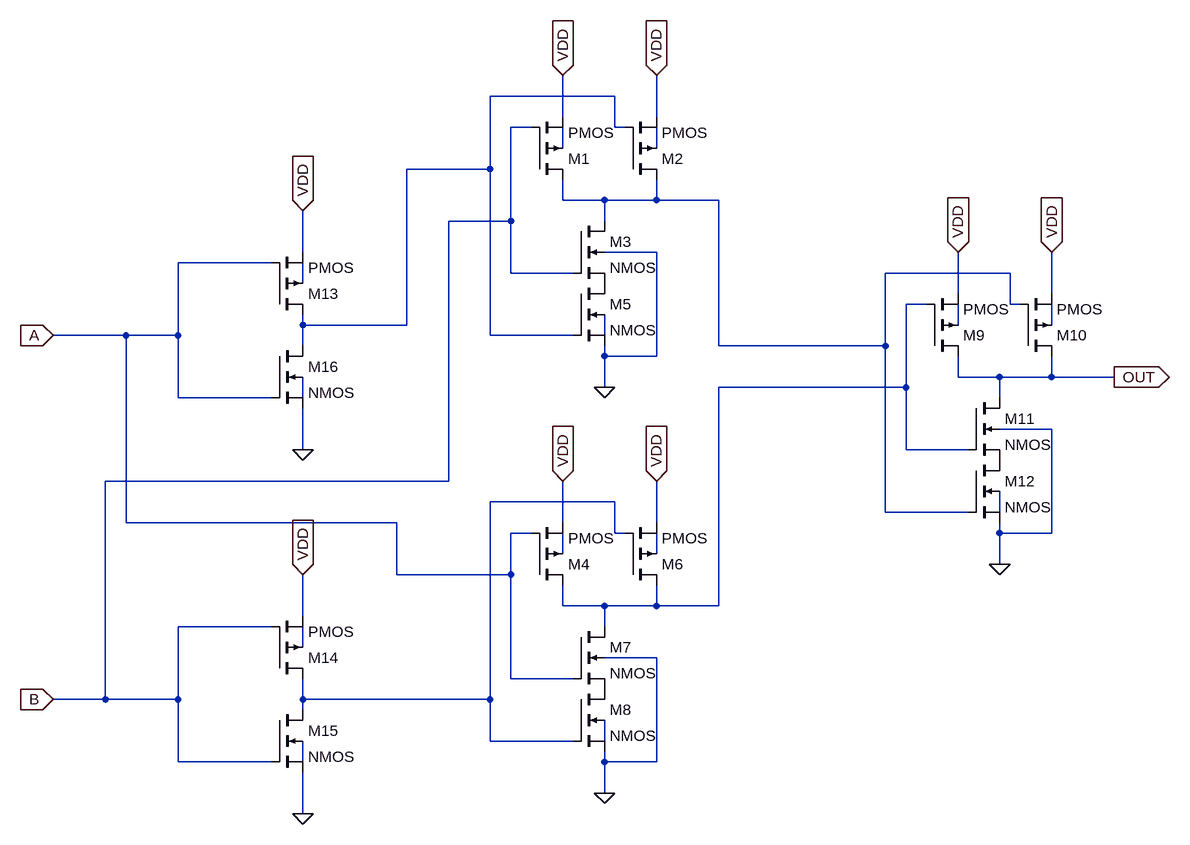
[diagram p0: schematic xor.asc]
xor.asc, the LTspice schematic file:
Version 4
SHEET 1 1132 916
WIRE 256 -208 64 -208
WIRE 176 -176 176 -240
WIRE 320 -176 320 -240
WIRE 128 -160 96 -160
WIRE 256 -160 256 -208
WIRE 272 -160 256 -160
WIRE 176 -128 176 -160
WIRE 320 -128 320 -160
WIRE 64 -96 64 -208
WIRE 64 -96 -64 -96
WIRE 176 -48 176 -80
WIRE 240 -48 176 -48
WIRE 320 -48 320 -80
WIRE 320 -48 240 -48
WIRE 416 -48 320 -48
WIRE 96 -16 96 -160
WIRE 96 -16 0 -16
WIRE 240 -16 240 -48
WIRE -224 32 -224 -32
WIRE 320 32 240 32
WIRE -272 48 -416 48
WIRE 96 64 96 -16
WIRE 192 64 96 64
WIRE 864 64 672 64
WIRE -224 80 -224 48
WIRE 784 96 784 32
WIRE 928 96 928 32
WIRE 736 112 704 112
WIRE 864 112 864 64
WIRE 880 112 864 112
WIRE -224 144 -224 128
WIRE -64 144 -64 -96
WIRE -64 144 -224 144
WIRE 784 144 784 112
WIRE 928 144 928 112
WIRE -496 160 -608 160
WIRE -416 160 -416 48
WIRE -416 160 -496 160
WIRE 64 160 64 -96
WIRE 192 160 64 160
WIRE 240 160 240 128
WIRE -224 176 -224 144
WIRE 416 176 416 -48
WIRE 672 176 672 64
WIRE 672 176 416 176
WIRE 240 192 240 176
WIRE 320 192 320 32
WIRE 320 192 240 192
WIRE 784 224 784 192
WIRE 848 224 784 224
WIRE 928 224 928 192
WIRE 928 224 848 224
WIRE 1024 224 928 224
WIRE 240 240 240 192
WIRE 704 240 704 112
WIRE 704 240 416 240
WIRE -416 256 -416 160
WIRE -272 256 -416 256
WIRE -224 256 -224 224
WIRE 848 256 848 224
WIRE 928 304 848 304
WIRE -224 336 -224 272
WIRE 704 336 704 240
WIRE 800 336 704 336
WIRE 0 384 0 -16
WIRE 0 384 -528 384
WIRE 256 416 64 416
WIRE 672 432 672 176
WIRE 800 432 672 432
WIRE 848 432 848 400
WIRE -496 448 -496 160
WIRE -80 448 -496 448
WIRE 176 448 176 384
WIRE 320 448 320 384
WIRE 128 464 96 464
WIRE 256 464 256 416
WIRE 272 464 256 464
WIRE 848 464 848 448
WIRE 928 464 928 304
WIRE 928 464 848 464
WIRE 176 496 176 464
WIRE 320 496 320 464
WIRE 848 512 848 464
WIRE -80 528 -80 448
WIRE 96 528 96 464
WIRE 96 528 -80 528
WIRE 176 576 176 544
WIRE 240 576 176 576
WIRE 320 576 320 544
WIRE 320 576 240 576
WIRE 416 576 416 240
WIRE 416 576 320 576
WIRE -224 592 -224 528
WIRE -272 608 -416 608
WIRE 240 608 240 576
WIRE -224 640 -224 608
WIRE 320 656 240 656
WIRE 96 688 96 528
WIRE 192 688 96 688
WIRE -528 720 -528 384
WIRE -528 720 -608 720
WIRE -416 720 -416 608
WIRE -416 720 -528 720
WIRE -224 720 -224 688
WIRE 64 720 64 416
WIRE 64 720 -224 720
WIRE -224 736 -224 720
WIRE 64 784 64 720
WIRE 192 784 64 784
WIRE 240 784 240 752
WIRE -416 816 -416 720
WIRE -272 816 -416 816
WIRE -224 816 -224 784
WIRE 240 816 240 800
WIRE 320 816 320 656
WIRE 320 816 240 816
WIRE 240 864 240 816
WIRE -224 896 -224 832
FLAG -608 160 A
IOPIN -608 160 In
FLAG -608 720 B
IOPIN -608 720 In
FLAG 320 -240 VDD
IOPIN 320 -240 In
FLAG 176 -240 VDD
IOPIN 176 -240 In
FLAG 240 240 0
FLAG 320 384 VDD
IOPIN 320 384 In
FLAG 176 384 VDD
IOPIN 176 384 In
FLAG 240 864 0
FLAG 1024 224 OUT
IOPIN 1024 224 Out
FLAG 928 32 VDD
IOPIN 928 32 In
FLAG 784 32 VDD
IOPIN 784 32 In
FLAG 848 512 0
FLAG -224 -32 VDD
IOPIN -224 -32 In
FLAG -224 336 0
FLAG -224 528 VDD
IOPIN -224 528 In
FLAG -224 896 0
SYMBOL pmos4 128 -80 M180
SYMATTR InstName M1
SYMATTR Value2 l=90n w=400n
SYMBOL pmos4 272 -80 M180
SYMATTR InstName M2
SYMATTR Value2 l=90n w=400n
SYMBOL nmos4 192 -16 R0
SYMATTR InstName M3
SYMATTR Value2 l=90n w=200n
SYMBOL nmos4 192 80 R0
SYMATTR InstName M5
SYMATTR Value2 l=90n w=200n
SYMBOL pmos4 128 544 M180
SYMATTR InstName M4
SYMATTR Value2 l=90n w=400n
SYMBOL pmos4 272 544 M180
SYMATTR InstName M6
SYMATTR Value2 l=90n w=400n
SYMBOL nmos4 192 608 R0
SYMATTR InstName M7
SYMATTR Value2 l=90n w=200n
SYMBOL nmos4 192 704 R0
SYMATTR InstName M8
SYMATTR Value2 l=90n w=200n
SYMBOL pmos4 736 192 M180
SYMATTR InstName M9
SYMATTR Value2 l=90n w=400n
SYMBOL pmos4 880 192 M180
SYMATTR InstName M10
SYMATTR Value2 l=90n w=400n
SYMBOL nmos4 800 256 R0
SYMATTR InstName M11
SYMATTR Value2 l=90n w=200n
SYMBOL nmos4 800 352 R0
SYMATTR InstName M12
SYMATTR Value2 l=90n w=200n
SYMBOL pmos4 -272 128 M180
SYMATTR InstName M13
SYMATTR Value2 l=90n w=400n
SYMBOL nmos4 -272 176 R0
SYMATTR InstName M16
SYMATTR Value2 l=90n w=200n
SYMBOL pmos4 -272 688 M180
SYMATTR InstName M14
SYMATTR Value2 l=90n w=400n
SYMBOL nmos4 -272 736 R0
SYMATTR InstName M15
SYMATTR Value2 l=90n w=200n

The netlist it stands for:
* xor.asc
M1 N004 B VDD N002 PMOS l=90n w=400n
M2 N004 N001 VDD N003 PMOS l=90n w=400n
M3 N004 B P001 0 NMOS l=90n w=200n
M5 P001 N001 0 N009 NMOS l=90n w=200n
M4 N006 A VDD N013 PMOS l=90n w=400n
M6 N006 N011 VDD N014 PMOS l=90n w=400n
M7 N006 A P002 0 NMOS l=90n w=200n
M8 P002 N011 0 N016 NMOS l=90n w=200n
M9 OUT N006 VDD N007 PMOS l=90n w=400n
M10 OUT N004 VDD N008 PMOS l=90n w=400n
M11 OUT N006 P003 0 NMOS l=90n w=200n
M12 P003 N004 0 N012 NMOS l=90n w=200n
M13 N001 A VDD N005 PMOS l=90n w=400n
M16 N001 A 0 N010 NMOS l=90n w=200n
M14 N011 B VDD N015 PMOS l=90n w=400n
M15 N011 B 0 N017 NMOS l=90n w=200n
.model NMOS NMOS
.model PMOS PMOS
.lib standard.mos
.backanno
.end